# Altium project ORINIUM_UAV.PrjPcb (part 4 of 5)
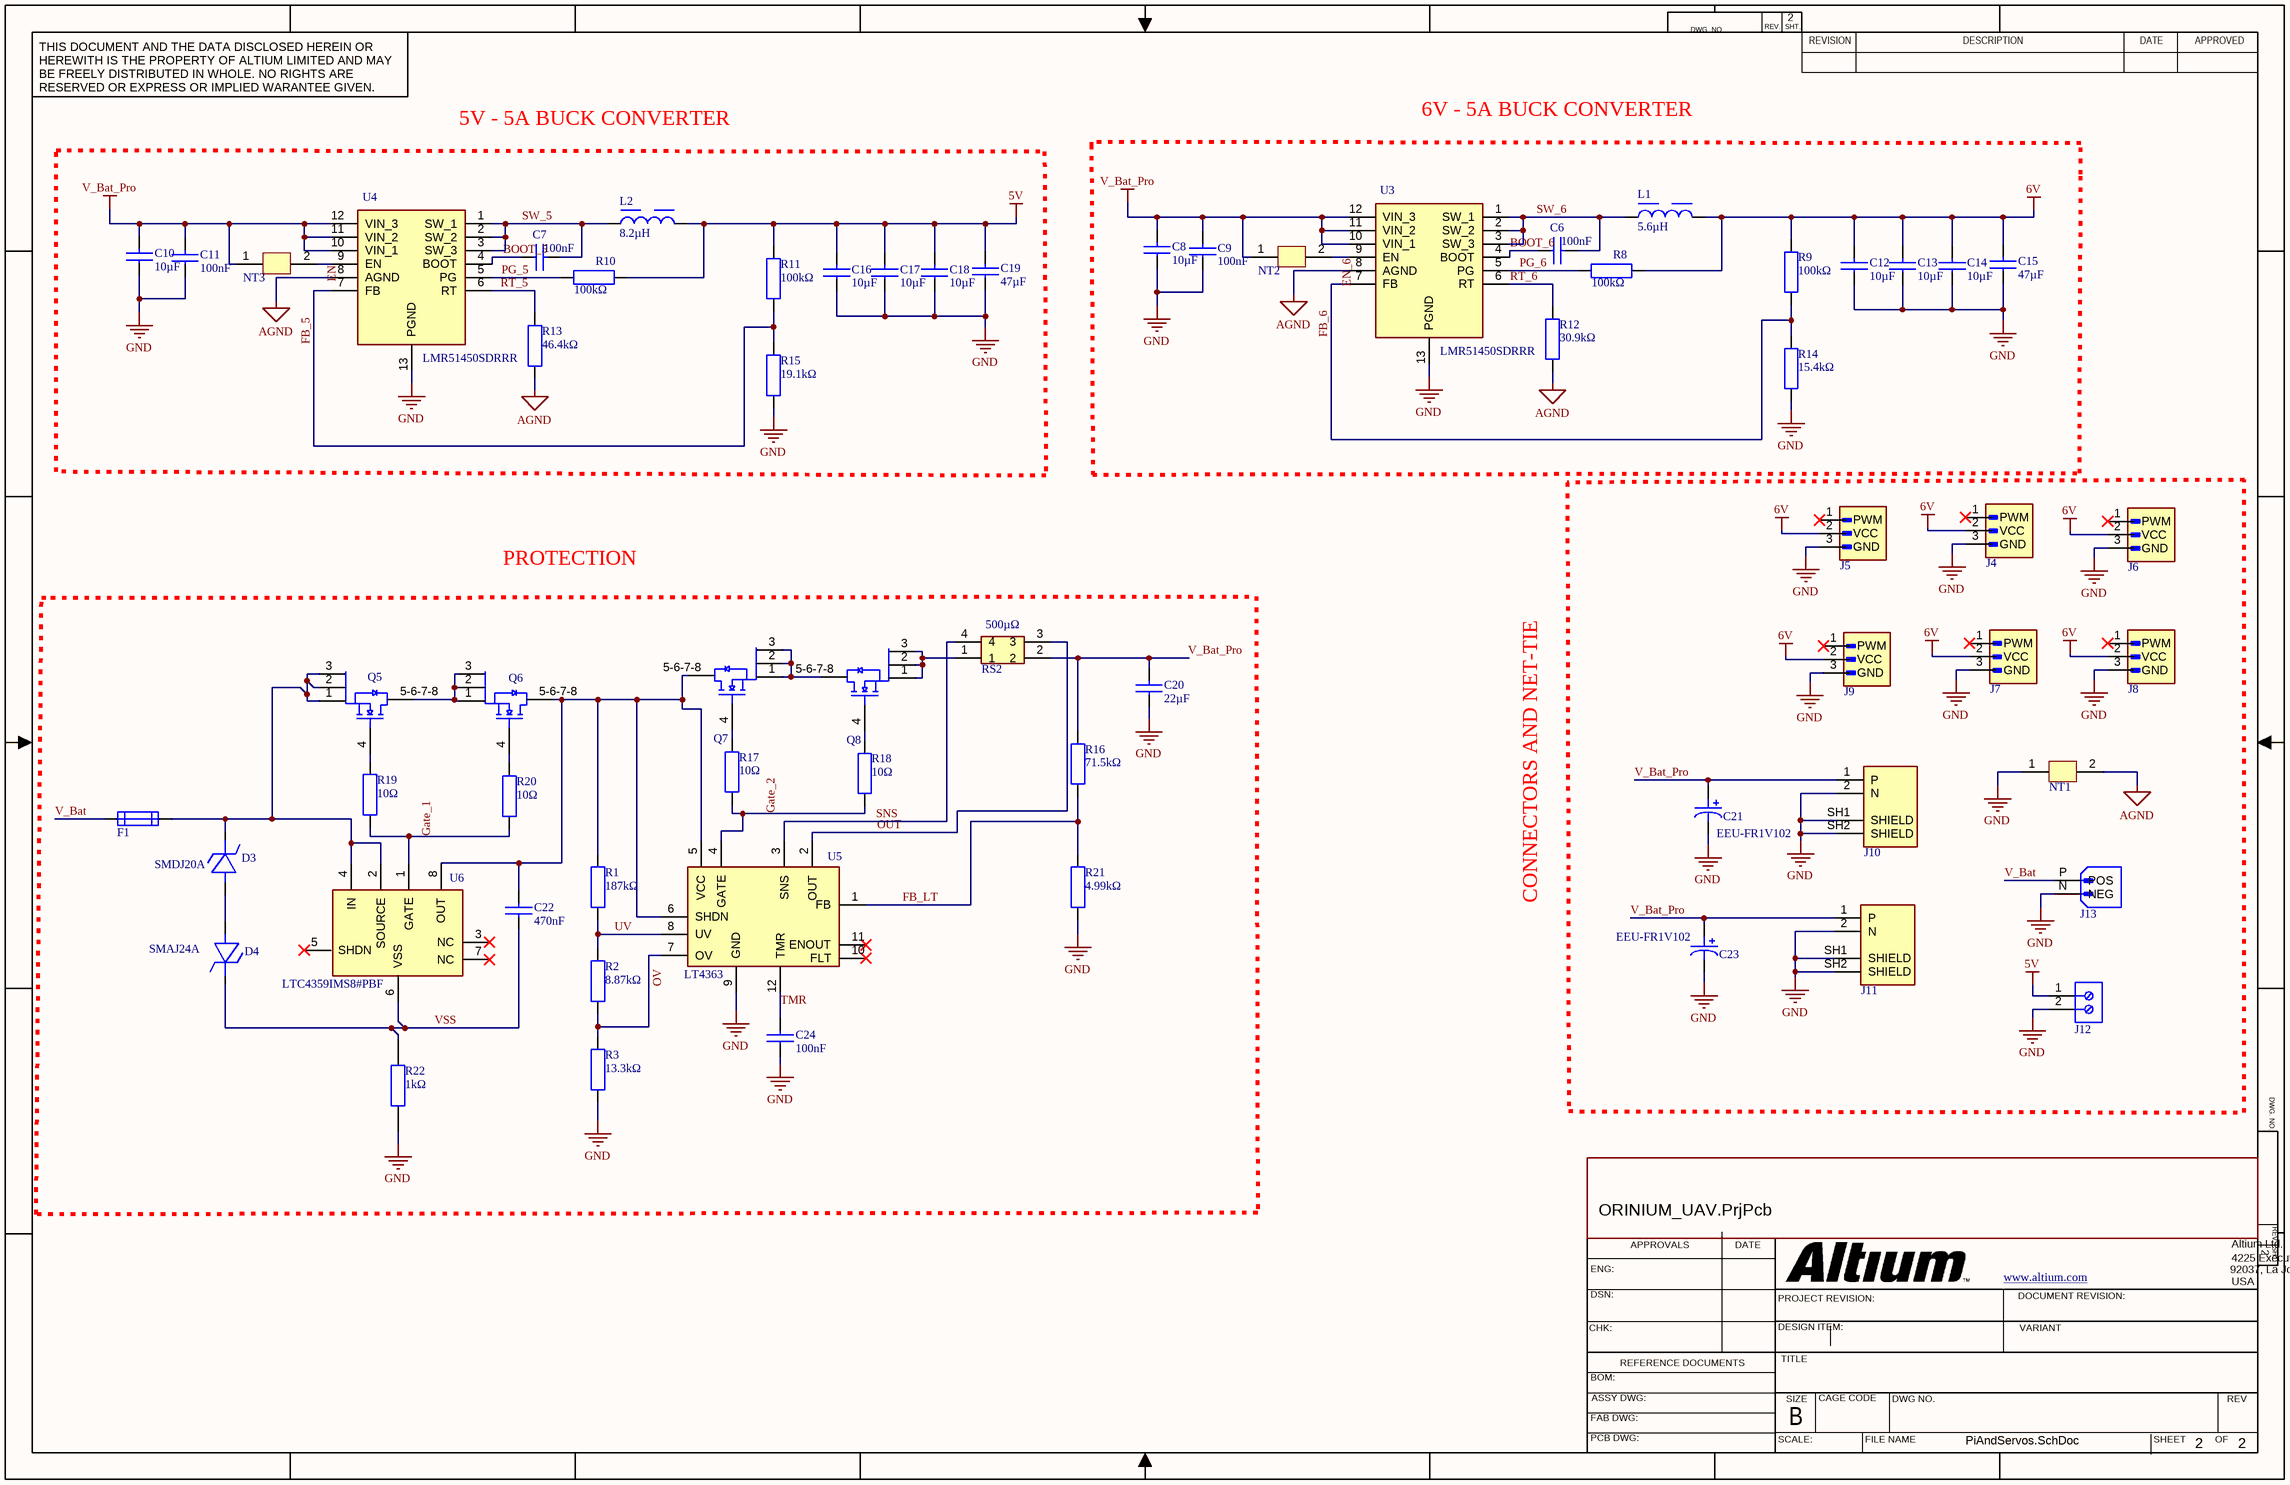
[diagram p3: PiAndServos.SchDoc]

## Sheet PiAndServos.SchDoc (continued)

### Library data of the parts (continued)
R13 = CRCW060346K4FKEA: Fixed Resistor, Metal Glaze/Thick Film, 0.1W, 46400ohm, 75V, 1% +/-Tol, Surface Mount, 0603; Manufacturer: Vishay; Max Power Dissipation: 100mW; Temperature Coefficient: 100ppm/°C; Supplier: Farnell; Supplier Part Number: CRCW060346K4FKEA; Manufacturer Part Number: CRCW060346K4FKEA; RoHS: Compliant; Category: Chip SMD Resistors; Stock: 5000; Pricing: 5000=0,0098 (EUR); Case/Package: 0603; Case Code (Imperial): 0603; China RoHS: Non-Compliant; Composition: Thick Film; Contact Plating: Tin; Country of Origin: Israel, Taiwan; Depth: 850µm; Export Control Classification Number (ECCN) Code: EAR99; Features: Automotive AEC-Q200; Height: 450µm; Harmonized Tariff Schedule (HTS) Code: 8533.21.00.30; Introduction Date: 2005-02-16; Lead Free: Lead Free; Length: 1.55mm; Lifecycle Status: Production; Max Operating Temperature: 155°C; Military Standard: Not; Min Operating Temperature: -55°C; Mounting Technology: Surface Mount; Pins: 2; Number of Terminals: 2; Number of Terminations: 2; Packaging: Cut Tape; Power Rating: 100mW; Radiation Hardening: No; Ratings: AEC-Q200; REACH SVHC: Yes; Schedule B: 8533210045, 8533210045|8533210045|8533210045|8533210045|8533210045|8533210045|8533210045|8533210045|8533210045|8533210045, 8533210045|8533210045|8533210045|8533210045|8533210045|8533210045|8533210045|8533210045|8533210045|8533210045|8533210045, 8533210045|8533210045|8533210045|8533210045|8533210045|8533210045|8533210045|8533210045|8533210045|8533210045|8533210045|8533210045; Termination: SMD/SMT; Tolerance: 1%; Voltage Rating: 75V; Weight: 2.012816mg; Width: 850µm; Working Voltage: 75V; ComponentLink1URL: https://datasheet.octopart.com:443/CRCW060346K4FKEA-Vishay-datasheet-175423584.pdf?src-supplier=IHS; ComponentLink1Description: https://datasheet.octopart.com:443/CRCW060346K4FKEA-Vishay-datasheet-175423584.pdf?src-supplier=IHS; ComponentLink2URL: https://datasheet.octopart.com:443/CRCW060346K4FKEA-Vishay-datasheet-62316122.pdf?src-supplier=Future+Electronics; ComponentLink2Description: https://datasheet.octopart.com:443/CRCW060346K4FKEA-Vishay-datasheet-62316122.pdf?src-supplier=Future+Electronics; ComponentLink3URL: https://datasheet.octopart.com:443/CRCW060346K4FKEA-Vishay-datasheet-12543454.pdf?src-supplier=Future+Electronics; ComponentLink3Description: https://datasheet.octopart.com:443/CRCW060346K4FKEA-Vishay-datasheet-12543454.pdf?src-supplier=Future+Electronics; ComponentLink4URL: https://datasheet.octopart.com:443/CRCW060346K4FKEA.-Vishay-datasheet-83961561.pdf?src-supplier=element14+APAC; ComponentLink4Description: https://datasheet.octopart.com:443/CRCW060346K4FKEA.-Vishay-datasheet-83961561.pdf?src-supplier=element14+APAC; ComponentLink5URL: https://datasheet.octopart.com:443/CRCW060346K4FKEA-Vishay-datasheet-62317933.pdf?src-supplier=element14+APAC; ComponentLink5Description: https://datasheet.octopart.com:443/CRCW060346K4FKEA-Vishay-datasheet-62317933.pdf?src-supplier=element14+APAC; ComponentLink6URL: https://datasheet.octopart.com:443/CRCW060346K4FKEA-Vishay-datasheet-14722531.pdf?src-supplier=element14+APAC; ComponentLink6Description: https://datasheet.octopart.com:443/CRCW060346K4FKEA-Vishay-datasheet-14722531.pdf?src-supplier=element14+APAC; ComponentLink7URL: https://datasheet.octopart.com:443/CRCW060346K4FKEA-Vishay-datasheet-5299586.pdf?src-supplier=element14+APAC; ComponentLink7Description: https://datasheet.octopart.com:443/CRCW060346K4FKEA-Vishay-datasheet-5299586.pdf?src-supplier=element14+APAC; ComponentLink8URL: https://datasheet.octopart.com:443/CRCW060346K4FKEA-Vishay-datasheet-10380026.pdf?src-supplier=element14+APAC; ComponentLink8Description: https://datasheet.octopart.com:443/CRCW060346K4FKEA-Vishay-datasheet-10380026.pdf?src-supplier=element14+APAC; ComponentLink9URL: https://datasheet.octopart.com:443/CRCW060346K4FKEA.-Vishay-datasheet-78776209.pdf?src-supplier=Newark; ComponentLink9Description: https://datasheet.octopart.com:443/CRCW060346K4FKEA.-Vishay-datasheet-78776209.pdf?src-supplier=Newark; ComponentLink10URL: https://datasheet.octopart.com:443/CRCW060346K4FKEA-Vishay-datasheet-66077789.pdf?src-supplier=Newark; ComponentLink10Description: https://datasheet.octopart.com:443/CRCW060346K4FKEA-Vishay-datasheet-66077789.pdf?src-supplier=Newark; ComponentLink11URL: https://datasheet.octopart.com:443/CRCW060346K4FKEA-Vishay-datasheet-11761042.pdf?src-supplier=Newark; ComponentLink11Description: https://datasheet.octopart.com:443/CRCW060346K4FKEA-Vishay-datasheet-11761042.pdf?src-supplier=Newark; ComponentLink12URL: https://datasheet.octopart.com:443/CRCW060346K4FKEA-Vishay-datasheet-11516975.pdf?src-supplier=Newark; ComponentLink12Description: https://datasheet.octopart.com:443/CRCW060346K4FKEA-Vishay-datasheet-11516975.pdf?src-supplier=Newark; ComponentLink13URL: https://datasheet.octopart.com:443/CRCW060346K4FKEA-Vishay-datasheet-159614168.pdf?src-supplier=Newark; ComponentLink13Description: https://datasheet.octopart.com:443/CRCW060346K4FKEA-Vishay-datasheet-159614168.pdf?src-supplier=Newark; ComponentLink14URL: https://datasheet.octopart.com:443/CRCW060346K4FKEA-Vishay-datasheet-41302739.pdf?src-supplier=Newark; ComponentLink14Description: https://datasheet.octopart.com:443/CRCW060346K4FKEA-Vishay-datasheet-41302739.pdf?src-supplier=Newark; ComponentLink15URL: https://datasheet.octopart.com:443/CRCW060346K4FKEA-Vishay-datasheet-33013972.pdf?src-supplier=Newark; ComponentLink15Description: https://datasheet.octopart.com:443/CRCW060346K4FKEA-Vishay-datasheet-33013972.pdf?src-supplier=Newark; ComponentLink16URL: https://datasheet.octopart.com:443/CRCW060346K4FKEA-Vishay-datasheet-21226360.pdf?src-supplier=Newark; ComponentLink16Description: https://datasheet.octopart.com:443/CRCW060346K4FKEA-Vishay-datasheet-21226360.pdf?src-supplier=Newark; ComponentLink17URL: https://datasheet.octopart.com:443/CRCW060346K4FKEA-Vishay-datasheet-137114372.pdf?src-supplier=X-ON; ComponentLink17Description: https://datasheet.octopart.com:443/CRCW060346K4FKEA-Vishay-datasheet-137114372.pdf?src-supplier=X-ON; ComponentLink18URL: https://datasheet.octopart.com:443/CRCW060346K4FKEA-Vishay-Dale-datasheet-47688880.pdf?src-supplier=RS+(Formerly+Allied+Electronics); ComponentLink18Description: https://datasheet.octopart.com:443/CRCW060346K4FKEA-Vishay-Dale-datasheet-47688880.pdf?src-supplier=RS+(Formerly+Allied+Electronics); ComponentLink19URL: https://datasheet.octopart.com:443/CRCW060346K4FKEA-Vishay-datasheet-12001583.pdf?src-supplier=RS+(Formerly+Allied+Electronics); ComponentLink19Description: https://datasheet.octopart.com:443/CRCW060346K4FKEA-Vishay-datasheet-12001583.pdf?src-supplier=RS+(Formerly+Allied+Electronics); ComponentLink20URL: https://datasheet.octopart.com:443/CRCW060346K4FKEA-Vishay-datasheet-5306405.pdf?src-supplier=RS+(Formerly+Allied+Electronics); ComponentLink20Description: https://datasheet.octopart.com:443/CRCW060346K4FKEA-Vishay-datasheet-5306405.pdf?src-supplier=RS+(Formerly+Allied+Electronics); ComponentLink21URL: https://datasheet.octopart.com:443/CRCW060346K4FKEA-Vishay-datasheet-11540273.pdf?src-supplier=Arrow+Electronics; ComponentLink21Description: https://datasheet.octopart.com:443/CRCW060346K4FKEA-Vishay-datasheet-11540273.pdf?src-supplier=Arrow+Electronics; ComponentLink22URL: https://datasheet.octopart.com:443/CRCW060346K4FKEA-Vishay-datasheet-8445837.pdf?src-supplier=element14; ComponentLink22Description: https://datasheet.octopart.com:443/CRCW060346K4FKEA-Vishay-datasheet-8445837.pdf?src-supplier=element14; ComponentLink23URL: https://datasheet.octopart.com:443/CRCW060346K4FKEA-Vishay-datasheet-5377433.pdf?src-supplier=Garrett; ComponentLink23Description: https://datasheet.octopart.com:443/CRCW060346K4FKEA-Vishay-datasheet-5377433.pdf?src-supplier=Garrett; ComponentLink24URL: https://datasheet.octopart.com:443/CRCW060346K4FKEA-Vishay-datasheet-148188.pdf?src-supplier=Garrett; ComponentLink24Description: https://datasheet.octopart.com:443/CRCW060346K4FKEA-Vishay-datasheet-148188.pdf?src-supplier=Garrett; ComponentLink25URL: https://datasheet.octopart.com:443/CRCW060346K4FKEA-Vishay-datasheet-30224.pdf?src-supplier=Garrett; ComponentLink25Description: https://datasheet.octopart.com:443/CRCW060346K4FKEA-Vishay-datasheet-30224.pdf?src-supplier=Garrett; ComponentLink26URL: http://sigma.octopart.com:80/rohs_statement/Vishay-company-15.pdf?src-supplier=Compliance+Statements; ComponentLink26Description: http://sigma.octopart.com:80/rohs_statement/Vishay-company-15.pdf?src-supplier=Compliance+Statements
R14 = AC0402FR-0715K4L: Res Thick Film 0402 15.4K Ohm 1% 0.063W(1/16W) ±100ppm/C Pad SMD Automotive T/R; Manufacturer: Yageo Group; Max Power Dissipation: 63mW; Power Rating: 62.5mW; Temperature Coefficient: 100ppm/°C; Voltage Rating: 50V; Supplier: Farnell; Supplier Part Number: AC0402FR-0715K4L.; Manufacturer Part Number: AC0402FR-0715K4L; RoHS: Compliant; Category: Chip SMD Resistors; Stock: 19685; Pricing: 1=0,0038 (EUR); Case/Package: 0402; Case Code (Imperial): 0402; Case Code (Metric): 1005; China RoHS: Non-Compliant; Composition: Thick Film; Features: Automotive AEC-Q200, Moisture Resistant; Height: 320µm; Length: 1mm; Lifecycle Status: Production; Max Operating Temperature: 155°C; Min Operating Temperature: -55°C; Mounting Technology: Surface Mount; Number of Terminals: 2; Number of Terminations: 2; Packaging: Tape & Reel; Ratings: AEC-Q200; REACH SVHC: Yes; Schedule B: 8533210045, 8533210045|8533210045|8533210045|8533210045|8533210045; Termination: SMD/SMT; Tolerance: 1%; Width: 500µm; Working Voltage: 50V; ComponentLink1URL: https://datasheet.octopart.com:443/AC0402FR-0715K4L-Yageo-datasheet-182189377.pdf?src-supplier=IHS; ComponentLink1Description: https://datasheet.octopart.com:443/AC0402FR-0715K4L-Yageo-datasheet-182189377.pdf?src-supplier=IHS; ComponentLink2URL: https://datasheet.octopart.com:443/AC0402FR-0715K4L-Yageo-datasheet-83209224.pdf?src-supplier=Upverter; ComponentLink2Description: https://datasheet.octopart.com:443/AC0402FR-0715K4L-Yageo-datasheet-83209224.pdf?src-supplier=Upverter; ComponentLink3URL: https://datasheet.octopart.com:443/AC0402FR-0715K4L-Yageo-datasheet-178509465.pdf?src-supplier=element14+APAC; ComponentLink3Description: https://datasheet.octopart.com:443/AC0402FR-0715K4L-Yageo-datasheet-178509465.pdf?src-supplier=element14+APAC; ComponentLink4URL: https://datasheet.octopart.com:443/AC0402FR-0715K4L-Yageo-Group-datasheet-189830439.pdf?src-supplier=Future+Electronics; ComponentLink4Description: https://datasheet.octopart.com:443/AC0402FR-0715K4L-Yageo-Group-datasheet-189830439.pdf?src-supplier=Future+Electronics; ComponentLink5URL: https://datasheet.octopart.com:443/AC0402FR-0715K4L-Yageo-datasheet-166720450.pdf?src-supplier=Future+Electronics; ComponentLink5Description: https://datasheet.octopart.com:443/AC0402FR-0715K4L-Yageo-datasheet-166720450.pdf?src-supplier=Future+Electronics; ComponentLink6URL: https://datasheet.octopart.com:443/AC0402FR-0715K4L-Yageo-datasheet-151884373.pdf?src-supplier=Future+Electronics; ComponentLink6Description: https://datasheet.octopart.com:443/AC0402FR-0715K4L-Yageo-datasheet-151884373.pdf?src-supplier=Future+Electronics; ComponentLink7URL: https://datasheet.octopart.com:443/AC0402FR-0715K4L-Yageo-datasheet-137699919.pdf?src-supplier=Future+Electronics; ComponentLink7Description: https://datasheet.octopart.com:443/AC0402FR-0715K4L-Yageo-datasheet-137699919.pdf?src-supplier=Future+Electronics; ComponentLink8URL: https://datasheet.octopart.com:443/AC0402FR-0715K4L-Yageo-Group-datasheet-164768995.pdf?src-supplier=ODG+(Origin+Data+Global); ComponentLink8Description: https://datasheet.octopart.com:443/AC0402FR-0715K4L-Yageo-Group-datasheet-164768995.pdf?src-supplier=ODG+(Origin+Data+Global); ComponentLink9URL: https://datasheet.octopart.com/AC0402FR-0715K4L-Yageo-datasheet-12512238.pdf; ComponentLink9Description: https://datasheet.octopart.com/AC0402FR-0715K4L-Yageo-datasheet-12512238.pdf; ComponentLink10URL: http://sigma.octopart.com:80/conflict_mineral_statement/Yageo-company-3.pdf?src-supplier=Compliance+Statements; ComponentLink10Description: http://sigma.octopart.com:80/conflict_mineral_statement/Yageo-company-3.pdf?src-supplier=Compliance+Statements; ComponentLink11URL: http://sigma.octopart.com:80/rohs_statement/Yageo-company-2.pdf?src-supplier=Compliance+Statements; ComponentLink11Description: http://sigma.octopart.com:80/rohs_statement/Yageo-company-2.pdf?src-supplier=Compliance+Statements
R15 = CRCW040219K1FKED: Res Thick Film 0402 19.1K Ohm 1% 1/16W ±100ppm/°C Molded SMD SMD Paper T/R; Manufacturer: Vishay; Max Power Dissipation: 63mW; Voltage Rating: 50V; Supplier: Farnell; Supplier Part Number: CRCW040219K1FKED; Manufacturer Part Number: CRCW040219K1FKED; RoHS: Compliant; Category: Chip SMD Resistors; Stock: 42036; Pricing: 10=0,02, 100=0,0145, 500=0,0117, 2500=0,0097, 5000=0,0094, 10000=0,009 (EUR); Case/Package: 0402; Case Code (Imperial): 0402; China RoHS: Non-Compliant; Composition: Thick Film; Contact Plating: Tin; Country of Origin: Israel, Taiwan; Depth: 500µm; Export Control Classification Number (ECCN) Code: EAR99; Features: Automotive AEC-Q200; Height: 350µm; Harmonized Tariff Schedule (HTS) Code: 8533.21.00.30; Introduction Date: 2005-03-24; Lead Free: Lead Free; Length: 1mm; Lifecycle Status: Production; Max Operating Temperature: 155°C; Military Standard: Not; Min Operating Temperature: -55°C; Mounting Technology: Surface Mount; Pins: 2; Number of Terminals: 2; Number of Terminations: 2; Packaging: Cut Tape; Power Rating: 63mW; Radiation Hardening: No; Ratings: AEC-Q200; REACH SVHC: Yes; Schedule B: 8533210045; Temperature Coefficient: 100ppm/°C; Termination: SMD/SMT; Tolerance: 1%; Voltage Rating (DC): 50V; Weight: 652.039032µg; Width: 500µm; Working Voltage: 50V; ComponentLink1URL: https://datasheet.octopart.com:443/CRCW040219K1FKED-Vishay-datasheet-175423584.pdf?src-supplier=IHS; ComponentLink1Description: https://datasheet.octopart.com:443/CRCW040219K1FKED-Vishay-datasheet-175423584.pdf?src-supplier=IHS; ComponentLink2URL: https://datasheet.octopart.com:443/CRCW040219K1FKED.-Vishay-datasheet-83961561.pdf?src-supplier=element14+APAC; ComponentLink2Description: https://datasheet.octopart.com:443/CRCW040219K1FKED.-Vishay-datasheet-83961561.pdf?src-supplier=element14+APAC; ComponentLink3URL: https://datasheet.octopart.com:443/CRCW040219K1FKED-Vishay-datasheet-66077789.pdf?src-supplier=element14+APAC; ComponentLink3Description: https://datasheet.octopart.com:443/CRCW040219K1FKED-Vishay-datasheet-66077789.pdf?src-supplier=element14+APAC; ComponentLink4URL: https://datasheet.octopart.com:443/CRCW040219K1FKED-Vishay-datasheet-62317933.pdf?src-supplier=element14+APAC; ComponentLink4Description: https://datasheet.octopart.com:443/CRCW040219K1FKED-Vishay-datasheet-62317933.pdf?src-supplier=element14+APAC; ComponentLink5URL: https://datasheet.octopart.com:443/CRCW040219K1FKED-Vishay-datasheet-14722531.pdf?src-supplier=element14+APAC; ComponentLink5Description: https://datasheet.octopart.com:443/CRCW040219K1FKED-Vishay-datasheet-14722531.pdf?src-supplier=element14+APAC; ComponentLink6URL: https://datasheet.octopart.com:443/CRCW040219K1FKED-Vishay-datasheet-5299586.pdf?src-supplier=element14+APAC; ComponentLink6Description: https://datasheet.octopart.com:443/CRCW040219K1FKED-Vishay-datasheet-5299586.pdf?src-supplier=element14+APAC; ComponentLink7URL: https://datasheet.octopart.com:443/CRCW040219K1FKED-Vishay-datasheet-10380026.pdf?src-supplier=element14+APAC; ComponentLink7Description: https://datasheet.octopart.com:443/CRCW040219K1FKED-Vishay-datasheet-10380026.pdf?src-supplier=element14+APAC; ComponentLink8URL: https://datasheet.octopart.com:443/CRCW040219K1FKED.-Vishay-datasheet-78776209.pdf?src-supplier=Newark; ComponentLink8Description: https://datasheet.octopart.com:443/CRCW040219K1FKED.-Vishay-datasheet-78776209.pdf?src-supplier=Newark; ComponentLink9URL: https://datasheet.octopart.com:443/CRCW040219K1FKED-Vishay-datasheet-11761042.pdf?src-supplier=Newark; ComponentLink9Description: https://datasheet.octopart.com:443/CRCW040219K1FKED-Vishay-datasheet-11761042.pdf?src-supplier=Newark; ComponentLink10URL: https://datasheet.octopart.com:443/CRCW040219K1FKED-Vishay-datasheet-11516975.pdf?src-supplier=Newark; ComponentLink10Description: https://datasheet.octopart.com:443/CRCW040219K1FKED-Vishay-datasheet-11516975.pdf?src-supplier=Newark; ComponentLink11URL: https://datasheet.octopart.com:443/CRCW040219K1FKED-Vishay-datasheet-159614168.pdf?src-supplier=Newark; ComponentLink11Description: https://datasheet.octopart.com:443/CRCW040219K1FKED-Vishay-datasheet-159614168.pdf?src-supplier=Newark; ComponentLink12URL: https://datasheet.octopart.com:443/CRCW040219K1FKED-Vishay-datasheet-41302739.pdf?src-supplier=Newark; ComponentLink12Description: https://datasheet.octopart.com:443/CRCW040219K1FKED-Vishay-datasheet-41302739.pdf?src-supplier=Newark; ComponentLink13URL: https://datasheet.octopart.com:443/CRCW040219K1FKED-Vishay-datasheet-33013972.pdf?src-supplier=Newark; ComponentLink13Description: https://datasheet.octopart.com:443/CRCW040219K1FKED-Vishay-datasheet-33013972.pdf?src-supplier=Newark; ComponentLink14URL: https://datasheet.octopart.com:443/CRCW040219K1FKED-Vishay-datasheet-21226360.pdf?src-supplier=Newark; ComponentLink14Description: https://datasheet.octopart.com:443/CRCW040219K1FKED-Vishay-datasheet-21226360.pdf?src-supplier=Newark; ComponentLink15URL: https://datasheet.octopart.com:443/CRCW040219K1FKED-Vishay-datasheet-62316122.pdf?src-supplier=Future+Electronics; ComponentLink15Description: https://datasheet.octopart.com:443/CRCW040219K1FKED-Vishay-datasheet-62316122.pdf?src-supplier=Future+Electronics; ComponentLink16URL: https://datasheet.octopart.com:443/CRCW040219K1FKED-Vishay-datasheet-12519820.pdf?src-supplier=Future+Electronics; ComponentLink16Description: https://datasheet.octopart.com:443/CRCW040219K1FKED-Vishay-datasheet-12519820.pdf?src-supplier=Future+Electronics; ComponentLink17URL: https://datasheet.octopart.com:443/CRCW040219K1FKED-Vishay-Dale-datasheet-47688880.pdf?src-supplier=RS+(Formerly+Allied+Electronics); ComponentLink17Description: https://datasheet.octopart.com:443/CRCW040219K1FKED-Vishay-Dale-datasheet-47688880.pdf?src-supplier=RS+(Formerly+Allied+Electronics); ComponentLink18URL: https://datasheet.octopart.com:443/CRCW040219K1FKED-Vishay-datasheet-12001583.pdf?src-supplier=RS+(Formerly+Allied+Electronics); ComponentLink18Description: https://datasheet.octopart.com:443/CRCW040219K1FKED-Vishay-datasheet-12001583.pdf?src-supplier=RS+(Formerly+Allied+Electronics); ComponentLink19URL: https://datasheet.octopart.com:443/CRCW040219K1FKED-Vishay-datasheet-5306405.pdf?src-supplier=RS+(Formerly+Allied+Electronics); ComponentLink19Description: https://datasheet.octopart.com:443/CRCW040219K1FKED-Vishay-datasheet-5306405.pdf?src-supplier=RS+(Formerly+Allied+Electronics); ComponentLink20URL: https://datasheet.octopart.com:443/CRCW040219K1FKED-Vishay-datasheet-11540273.pdf?src-supplier=Arrow+Electronics; ComponentLink20Description: https://datasheet.octopart.com:443/CRCW040219K1FKED-Vishay-datasheet-11540273.pdf?src-supplier=Arrow+Electronics; ComponentLink21URL: https://datasheet.octopart.com:443/CRCW040219K1FKED-Vishay-datasheet-8445837.pdf?src-supplier=element14; ComponentLink21Description: https://datasheet.octopart.com:443/CRCW040219K1FKED-Vishay-datasheet-8445837.pdf?src-supplier=element14; ComponentLink22URL: https://datasheet.octopart.com:443/CRCW040219K1FKED-Vishay-datasheet-5377255.pdf?src-supplier=Garrett; ComponentLink22Description: https://datasheet.octopart.com:443/CRCW040219K1FKED-Vishay-datasheet-5377255.pdf?src-supplier=Garrett; ComponentLink23URL: https://datasheet.octopart.com:443/CRCW040219K1FKED-Vishay-datasheet-148188.pdf?src-supplier=Garrett; ComponentLink23Description: https://datasheet.octopart.com:443/CRCW040219K1FKED-Vishay-datasheet-148188.pdf?src-supplier=Garrett; ComponentLink24URL: https://datasheet.octopart.com:443/CRCW040219K1FKED-Vishay-datasheet-42367.pdf?src-supplier=Garrett; ComponentLink24Description: https://datasheet.octopart.com:443/CRCW040219K1FKED-Vishay-datasheet-42367.pdf?src-supplier=Garrett; ComponentLink25URL: http://sigma.octopart.com:80/rohs_statement/Vishay-company-15.pdf?src-supplier=Compliance+Statements; ComponentLink25Description: http://sigma.octopart.com:80/rohs_statement/Vishay-company-15.pdf?src-supplier=Compliance+Statements
R16 = RC0603FR-0771K5L: Res Thick Film 0603 71.5K Ohm 1% 0.1W(1/10W) ±100ppm/C Pad SMD T/R; Manufacturer: Yageo Group; Max Power Dissipation: 100mW; Temperature Coefficient: 100ppm/°C; Voltage Rating: 75V; Voltage Rating (DC): 50V; Supplier: Farnell; Supplier Part Number: RC0603FR-0771K5L; Manufacturer Part Number: RC0603FR-0771K5L; RoHS: Compliant; Category: Chip SMD Resistors; Stock: 10380; Pricing: 10=0,0061, 100=0,0052, 500=0,0048, 1000=0,0043, 2500=0,0037 (EUR); Case/Package: 0603; Case Code (Imperial): 0603; China RoHS: Non-Compliant; Composition: Thick Film; Country of Origin: Mainland China, Taiwan; Export Control Classification Number (ECCN) Code: EAR99; Features: Moisture Resistant; Height: 450µm; Harmonized Tariff Schedule (HTS) Code: 8533.21.00.30; Introduction Date: 2004-09-22; Lead Free: Lead Free; Length: 1.6mm; Lifecycle Status: Production; Max Operating Temperature: 155°C; Min Operating Temperature: -55°C; Mounting Technology: Surface Mount; Number of Terminals: 2; Number of Terminations: 2; Packaging: Tape & Reel; Power Rating: 100mW; REACH SVHC: Yes; Schedule B: 8533210045, 8533210045|8533210045, 8533210045|8533210045|8533210045, 8533210045|8533210045|8533210045|8533210045; Termination: SMD/SMT; Tolerance: 1%; Weight: 2.012816mg; Width: 800µm; Working Voltage: 75V; ComponentLink1URL: https://datasheet.octopart.com:443/RC0603FR-0771K5L-Yageo-datasheet-175887523.pdf?src-supplier=Newark; ComponentLink1Description: https://datasheet.octopart.com:443/RC0603FR-0771K5L-Yageo-datasheet-175887523.pdf?src-supplier=Newark; ComponentLink2URL: https://datasheet.octopart.com:443/RC0603FR-0771K5L-Yageo-datasheet-103092701.pdf?src-supplier=Upverter; ComponentLink2Description: https://datasheet.octopart.com:443/RC0603FR-0771K5L-Yageo-datasheet-103092701.pdf?src-supplier=Upverter; ComponentLink3URL: https://datasheet.octopart.com:443/RC0603FR-0771K5L-Yageo-Group-datasheet-190305687.pdf?src-supplier=Future+Electronics; ComponentLink3Description: https://datasheet.octopart.com:443/RC0603FR-0771K5L-Yageo-Group-datasheet-190305687.pdf?src-supplier=Future+Electronics; ComponentLink4URL: https://datasheet.octopart.com:443/RC0603FR-0771K5L-Yageo-datasheet-164759695.pdf?src-supplier=Future+Electronics; ComponentLink4Description: https://datasheet.octopart.com:443/RC0603FR-0771K5L-Yageo-datasheet-164759695.pdf?src-supplier=Future+Electronics; ComponentLink5URL: https://datasheet.octopart.com:443/RC0603FR-0771K5L-Yageo-datasheet-137700087.pdf?src-supplier=Future+Electronics; ComponentLink5Description: https://datasheet.octopart.com:443/RC0603FR-0771K5L-Yageo-datasheet-137700087.pdf?src-supplier=Future+Electronics; ComponentLink6URL: https://datasheet.octopart.com:443/RC0603FR-0771K5L-Yageo-datasheet-17842380.pdf?src-supplier=Future+Electronics; ComponentLink6Description: https://datasheet.octopart.com:443/RC0603FR-0771K5L-Yageo-datasheet-17842380.pdf?src-supplier=Future+Electronics; ComponentLink7URL: https://datasheet.octopart.com:443/RC0603FR-0771K5L-Yageo-datasheet-15599030.pdf?src-supplier=Future+Electronics; ComponentLink7Description: https://datasheet.octopart.com:443/RC0603FR-0771K5L-Yageo-datasheet-15599030.pdf?src-supplier=Future+Electronics; ComponentLink8URL: https://datasheet.octopart.com:443/RC0603FR-0771K5L-Yageo-datasheet-12596169.pdf?src-supplier=Future+Electronics; ComponentLink8Description: https://datasheet.octopart.com:443/RC0603FR-0771K5L-Yageo-datasheet-12596169.pdf?src-supplier=Future+Electronics; ComponentLink9URL: https://datasheet.octopart.com:443/RC0603FR-0771K5L-Yageo-datasheet-8328172.pdf?src-supplier=Future+Electronics; ComponentLink9Description: https://datasheet.octopart.com:443/RC0603FR-0771K5L-Yageo-datasheet-8328172.pdf?src-supplier=Future+Electronics; ComponentLink10URL: https://datasheet.octopart.com:443/RC0603FR-0771K5L-Yageo-Group-datasheet-189192902.pdf?src-supplier=TME; ComponentLink10Description: https://datasheet.octopart.com:443/RC0603FR-0771K5L-Yageo-Group-datasheet-189192902.pdf?src-supplier=TME; ComponentLink11URL: https://datasheet.octopart.com:443/RC0603FR-0771K5L-Yageo-Group-datasheet-176638170.pdf?src-supplier=TME; ComponentLink11Description: https://datasheet.octopart.com:443/RC0603FR-0771K5L-Yageo-Group-datasheet-176638170.pdf?src-supplier=TME; ComponentLink12URL: https://datasheet.octopart.com:443/RC0603FR-0771K5L-Yageo-datasheet-79472498.pdf?src-supplier=Megastar; ComponentLink12Description: https://datasheet.octopart.com:443/RC0603FR-0771K5L-Yageo-datasheet-79472498.pdf?src-supplier=Megastar; ComponentLink13URL: https://datasheet.octopart.com/RC0603FR-0771K5L-Yageo-datasheet-73766026.pdf; ComponentLink13Description: https://datasheet.octopart.com/RC0603FR-0771K5L-Yageo-datasheet-73766026.pdf; ComponentLink14URL: https://datasheet.octopart.com:443/RC0603FR-0771K5L-Yageo-datasheet-118562.pdf?src-supplier=DigiKey; ComponentLink14Description: https://datasheet.octopart.com:443/RC0603FR-0771K5L-Yageo-datasheet-118562.pdf?src-supplier=DigiKey; ComponentLink15URL: http://sigma.octopart.com:80/conflict_mineral_statement/Yageo-company-3.pdf?src-supplier=Compliance+Statements; ComponentLink15Description: http://sigma.octopart.com:80/conflict_mineral_statement/Yageo-company-3.pdf?src-supplier=Compliance+Statements; ComponentLink16URL: http://sigma.octopart.com:80/rohs_statement/Yageo-company-2.pdf?src-supplier=Compliance+Statements; ComponentLink16Description: http://sigma.octopart.com:80/rohs_statement/Yageo-company-2.pdf?src-supplier=Compliance+Statements
R17-R20 = SR0805FR-7W10RL: Res Thick Film 0805 10 Ohm 1% 0.25W(1/4W) ±200ppm/C Pad SMD Automotive T/R; Manufacturer: Yageo Group; Power Rating: 250mW; Temperature Coefficient: 100ppm/°C; Voltage Rating: 150V; Working Voltage: 500V; Supplier: Arrow Electronics; Supplier Part Number: SR0805FR-7W10RL; Manufacturer Part Number: SR0805FR-7W10RL; RoHS: Compliant; Category: Chip SMD Resistors; Stock: 30000; Pricing: 5000=0,0587, 10000=0,0564 (USD); Case/Package: 0805; China RoHS: Non-Compliant; Composition: Thick Film; Country of Origin: Mainland China, Taiwan; Export Control Classification Number (ECCN) Code: EAR99; Height: 500µm; Harmonized Tariff Schedule (HTS) Code: 8533.21.00.30; Introduction Date: 2017-06-07; Length: 2mm; Lifecycle Status: Production; Max Operating Temperature: 155°C; Min Operating Temperature: -55°C; Mounting Technology: Surface Mount; Number of Terminals: 2; Packaging: Tape & Reel; Ratings: AEC-Q200; REACH SVHC: Yes; Tolerance: 1%; Width: 1.25mm; ComponentLink1URL: https://datasheet.octopart.com:443/SR0805FR-7W10RL-Yageo-datasheet-176402240.pdf?src-supplier=JRH+Electronics; ComponentLink1Description: https://datasheet.octopart.com:443/SR0805FR-7W10RL-Yageo-datasheet-176402240.pdf?src-supplier=JRH+Electronics; ComponentLink2URL: https://datasheet.octopart.com:443/SR0805FR-7W10RL-Yageo-datasheet-119732217.pdf?src-supplier=Upverter; ComponentLink2Description: https://datasheet.octopart.com:443/SR0805FR-7W10RL-Yageo-datasheet-119732217.pdf?src-supplier=Upverter; ComponentLink3URL: https://datasheet.octopart.com:443/SR0805FR-7W10RL-Yageo-datasheet-155675517.pdf?src-supplier=ODG+(Origin+Data+Global); ComponentLink3Description: https://datasheet.octopart.com:443/SR0805FR-7W10RL-Yageo-datasheet-155675517.pdf?src-supplier=ODG+(Origin+Data+Global); ComponentLink4URL: https://datasheet.octopart.com:443/SR0805FR-7W10RL-Yageo-Group-datasheet-184785656.pdf?src-supplier=Future+Electronics; ComponentLink4Description: https://datasheet.octopart.com:443/SR0805FR-7W10RL-Yageo-Group-datasheet-184785656.pdf?src-supplier=Future+Electronics; ComponentLink5URL: https://datasheet.octopart.com:443/SR0805FR-7W10RL-Yageo-datasheet-137701088.pdf?src-supplier=Future+Electronics; ComponentLink5Description: https://datasheet.octopart.com:443/SR0805FR-7W10RL-Yageo-datasheet-137701088.pdf?src-supplier=Future+Electronics; ComponentLink6URL: https://datasheet.octopart.com:443/SR0805FR-7W10RL-Yageo-Group-datasheet-188692432.pdf?src-supplier=Farnell; ComponentLink6Description: https://datasheet.octopart.com:443/SR0805FR-7W10RL-Yageo-Group-datasheet-188692432.pdf?src-supplier=Farnell; ComponentLink7URL: https://datasheet.octopart.com/SR0805FR-7W10RL-Yageo-datasheet-11047080.pdf; ComponentLink7Description: https://datasheet.octopart.com/SR0805FR-7W10RL-Yageo-datasheet-11047080.pdf; ComponentLink8URL: http://sigma.octopart.com:80/conflict_mineral_statement/Yageo-company-3.pdf?src-supplier=Compliance+Statements; ComponentLink8Description: http://sigma.octopart.com:80/conflict_mineral_statement/Yageo-company-3.pdf?src-supplier=Compliance+Statements; ComponentLink9URL: http://sigma.octopart.com:80/rohs_statement/Yageo-company-2.pdf?src-supplier=Compliance+Statements; ComponentLink9Description: http://sigma.octopart.com:80/rohs_statement/Yageo-company-2.pdf?src-supplier=Compliance+Statements
R21 = ERJ-2RKF4991X: Res Thick Film 0402 4.99K Ohm 1% 0.1W(1/10W) ±100ppm/C Pad SMD Automotive T/R; Manufacturer: Panasonic; Manufacturer Part Number: ERJ2RKF4991X; Manufacturer Lifecycle Status: ACTIVE; Part Series: Precision Thick Film Chip Resistors; Max Power Dissipation: 100mW; Temperature Coefficient: 100ppm/°C; Voltage Rating: 50V; Supplier: Farnell; Supplier Part Number: ERJ2RKF4991X; RoHS: Compliant; Category: Chip SMD Resistors; Stock: 140569; Pricing: 10=0,0178, 100=0,0146, 500=0,0095, 2500=0,0084, 5000=0,0074 (EUR); Case/Package: 0402; Case Code (Imperial): 0402; China RoHS: Non-Compliant; Composition: Thick Film; Contact Plating: Tin; Country of Origin: Japan, Mainland China; Depth: 500µm; Export Control Classification Number (ECCN) Code: EAR99; Features: Automotive AEC-Q200; Height: 350µm; Harmonized Tariff Schedule (HTS) Code: 8533.21.00.30; Introduction Date: 2004-02-02; Lead Free: Lead Free; Length: 1mm; Lifecycle Status: Production; Max Operating Temperature: 155°C; Military Standard: Not; Min Operating Temperature: -55°C; Mounting Technology: Surface Mount; Pins: 2; Number of Terminals: 2; Number of Terminations: 2; Packaging: Cut Tape; Power Rating: 100mW; Radiation Hardening: No; Ratings: AEC-Q200; REACH SVHC: Yes; Schedule B: 8533210045, 8533210045|8533210045|8533210045|8533210045|8533210045; Termination: SMD/SMT; Tolerance: 1%; Voltage Rating (DC): 50V; Weight: 793.786648µg; Width: 500µm; Working Voltage: 50V; ComponentLink1URL: https://sigma.octopart.com:443/138766958/technical_drawing/Panasonic-ERJ-2RKF4991X.pdf?src-supplier=Upverter; ComponentLink1Description: https://sigma.octopart.com:443/138766958/technical_drawing/Panasonic-ERJ-2RKF4991X.pdf?src-supplier=Upverter; ComponentLink2URL: https://datasheet.octopart.com:443/ERJ2RKF4991X-Panasonic-datasheet-82288794.pdf?src-supplier=Upverter; ComponentLink2Description: https://datasheet.octopart.com:443/ERJ2RKF4991X-Panasonic-datasheet-82288794.pdf?src-supplier=Upverter; ComponentLink3URL: https://datasheet.octopart.com:443/ERJ2RKF4991X-Panasonic-datasheet-13266541.pdf?src-supplier=RS+(Formerly+Allied+Electronics); ComponentLink3Description: https://datasheet.octopart.com:443/ERJ2RKF4991X-Panasonic-datasheet-13266541.pdf?src-supplier=RS+(Formerly+Allied+Electronics); ComponentLink4URL: https://datasheet.octopart.com:443/ERJ2RKF4991X-Panasonic-datasheet-48891056.pdf?src-supplier=Newark; ComponentLink4Description: https://datasheet.octopart.com:443/ERJ2RKF4991X-Panasonic-datasheet-48891056.pdf?src-supplier=Newark; ComponentLink5URL: https://datasheet.octopart.com:443/ERJ2RKF4991X-Panasonic-datasheet-136608610.pdf?src-supplier=Newark; ComponentLink5Description: https://datasheet.octopart.com:443/ERJ2RKF4991X-Panasonic-datasheet-136608610.pdf?src-supplier=Newark; ComponentLink6URL: https://datasheet.octopart.com:443/ERJ2RKF4991X-Panasonic-datasheet-10025800.pdf?src-supplier=Future+Electronics; ComponentLink6Description: https://datasheet.octopart.com:443/ERJ2RKF4991X-Panasonic-datasheet-10025800.pdf?src-supplier=Future+Electronics; ComponentLink7URL: https://datasheet.octopart.com:443/ERJ2RKF4991X-Panasonic-datasheet-8853621.pdf?src-supplier=Future+Electronics; ComponentLink7Description: https://datasheet.octopart.com:443/ERJ2RKF4991X-Panasonic-datasheet-8853621.pdf?src-supplier=Future+Electronics; ComponentLink8URL: https://datasheet.octopart.com:443/ERJ2RKF4991X-Panasonic-datasheet-5313456.pdf?src-supplier=Future+Electronics; ComponentLink8Description: https://datasheet.octopart.com:443/ERJ2RKF4991X-Panasonic-datasheet-5313456.pdf?src-supplier=Future+Electronics; ComponentLink9URL: https://datasheet.octopart.com:443/ERJ-2RKF4991X-Panasonic-datasheet-154766169.pdf?src-supplier=Master+Electronics; ComponentLink9Description: https://datasheet.octopart.com:443/ERJ-2RKF4991X-Panasonic-datasheet-154766169.pdf?src-supplier=Master+Electronics; ComponentLink10URL: https://datasheet.octopart.com:443/ERJ2RKF4991X-Panasonic-datasheet-188592431.pdf?src-supplier=TME; ComponentLink10Description: https://datasheet.octopart.com:443/ERJ2RKF4991X-Panasonic-datasheet-188592431.pdf?src-supplier=TME; ComponentLink11URL: https://datasheet.octopart.com:443/ERJ2RKF4991X-Panasonic-datasheet-164353789.pdf?src-supplier=TME; ComponentLink11Description: https://datasheet.octopart.com:443/ERJ2RKF4991X-Panasonic-datasheet-164353789.pdf?src-supplier=TME; ComponentLink12URL: https://datasheet.octopart.com/ERJ2RKF4991X-Panasonic-datasheet-78375410.pdf; ComponentLink12Description: https://datasheet.octopart.com/ERJ2RKF4991X-Panasonic-datasheet-78375410.pdf; ComponentLink13URL: https://datasheet.octopart.com/Precision-Thick-Film-Chip-Resistors-Panasonic-datasheet-family-106.pdf; ComponentLink13Description: https://datasheet.octopart.com/Precision-Thick-Film-Chip-Resistors-Panasonic-datasheet-family-106.pdf; ComponentLink14URL: https://datasheet.octopart.com:443/ERJ-2RKF4991X-Panasonic---ECG-datasheet-15994758.pdf?src-supplier=Farnell; ComponentLink14Description: https://datasheet.octopart.com:443/ERJ-2RKF4991X-Panasonic---ECG-datasheet-15994758.pdf?src-supplier=Farnell; ComponentLink15URL: https://datasheet.octopart.com:443/ERJ-2RKF4991X-Panasonic-datasheet-11542829.pdf?src-supplier=Arrow+Electronics; ComponentLink15Description: https://datasheet.octopart.com:443/ERJ-2RKF4991X-Panasonic-datasheet-11542829.pdf?src-supplier=Arrow+Electronics; ComponentLink16URL: https://datasheet.octopart.com:443/ERJ-2RKF4991X-Panasonic-datasheet-118621.pdf?src-supplier=DigiKey; ComponentLink16Description: https://datasheet.octopart.com:443/ERJ-2RKF4991X-Panasonic-datasheet-118621.pdf?src-supplier=DigiKey; ComponentLink17URL: https://datasheet.octopart.com:443/ERJ-2RKF4991X-Panasonic-datasheet-41391857.pdf?src-supplier=Electro+Sonic; ComponentLink17Description: https://datasheet.octopart.com:443/ERJ-2RKF4991X-Panasonic-datasheet-41391857.pdf?src-supplier=Electro+Sonic
R22 = SR1206FR-071KL: Fixed Resistor, Metal Glaze/thick Film, 0.25W, 1000ohm, 500V, 1% +/-Tol, 100ppm/Cel, Surface Mount, 1206; Manufacturer: Yageo Group; Max Power Dissipation: 250mW; Temperature Coefficient: 100ppm/°C; Working Voltage: 200V; Supplier: Avnet; Supplier Part Number: SR1206FR-071KL; Manufacturer Part Number: SR1206FR-071KL; RoHS: Compliant; Category: Chip SMD Resistors; Pricing: 5000=0,02852, 10000=0,02837, 20000=0,02823, 30000=0,02808, 40000=0,02794 (USD); Case/Package: 1206; China RoHS: Non-Compliant; Composition: Thick Film; Country of Origin: Mainland China, Taiwan; Export Control Classification Number (ECCN) Code: EAR99; Features: Automotive AEC-Q200; Height: 550µm; Harmonized Tariff Schedule (HTS) Code: 8533.21.00.30; Introduction Date: 2015-12-01; Length: 3.1mm; Lifecycle Status: Production; Max Operating Temperature: 155°C; Min Operating Temperature: -55°C; Mounting Technology: Surface Mount; Number of Terminals: 2; Number of Terminations: 2; Packaging: Tape & Reel; Power Rating: 250mW; Ratings: AEC-Q200; REACH SVHC: Yes; Tolerance: 1%; Width: 1.6mm; ComponentLink1URL: https://datasheet.octopart.com:443/SR1206FR-071KL-Yageo-datasheet-176402240.pdf?src-supplier=IHS; ComponentLink1Description: https://datasheet.octopart.com:443/SR1206FR-071KL-Yageo-datasheet-176402240.pdf?src-supplier=IHS; ComponentLink2URL: https://datasheet.octopart.com/SR1206FR-071KL-Yageo-datasheet-11047080.pdf; ComponentLink2Description: https://datasheet.octopart.com/SR1206FR-071KL-Yageo-datasheet-11047080.pdf; ComponentLink3URL: http://sigma.octopart.com:80/conflict_mineral_statement/Yageo-company-3.pdf?src-supplier=Compliance+Statements; ComponentLink3Description: http://sigma.octopart.com:80/conflict_mineral_statement/Yageo-company-3.pdf?src-supplier=Compliance+Statements; ComponentLink4URL: http://sigma.octopart.com:80/rohs_statement/Yageo-company-2.pdf?src-supplier=Compliance+Statements; ComponentLink4Description: http://sigma.octopart.com:80/rohs_statement/Yageo-company-2.pdf?src-supplier=Compliance+Statements
RS2 = WSLP4026L5000FEA: Res Metal Strip 4026 0.0005 Ohm 1% 7W ±75ppm/C Metal Pad SMD Automotive T/R; Manufacturer: Vishay; Temperature Coefficient: 75ppm/°C; Working Voltage: 59.2mV; Supplier: Future Electronics; Supplier Part Number: WSLP4026L5000FEA; Manufacturer Part Number: WSLP4026L5000FEA; RoHS: Compliant; Category: Chip SMD Resistors; Pricing: 1500=2 (USD); Case/Package: 4026; Case Code (Imperial): 4026; Case Code (Metric): 1066; China RoHS: Compliant; Composition: Metal Strip; Features: Moisture Resistant; Height: 2.95mm; Length: 10.1mm; Lifecycle Status: Production; Max Operating Temperature: 170°C; Max Power Dissipation: 7W; Min Operating Temperature: -65°C; Mounting Technology: Surface Mount; Number of Terminals: 4; Number of Terminations: 4; Power Rating: 7W; Ratings: AEC-Q200; REACH SVHC: Yes; Tolerance: 1%; Width: 6.6mm; ComponentLink1URL: https://datasheet.octopart.com:443/WSLP4026L5000FEA-Vishay-datasheet-181963782.pdf?src-supplier=IHS; ComponentLink1Description: https://datasheet.octopart.com:443/WSLP4026L5000FEA-Vishay-datasheet-181963782.pdf?src-supplier=IHS; ComponentLink2URL: https://datasheet.octopart.com:443/WSLP4026L5000FEA-Vishay-datasheet-62319862.pdf?src-supplier=Newark; ComponentLink2Description: https://datasheet.octopart.com:443/WSLP4026L5000FEA-Vishay-datasheet-62319862.pdf?src-supplier=Newark; ComponentLink3URL: https://datasheet.octopart.com:443/WSLP4026L5000FEA-Vishay-datasheet-25365648.pdf?src-supplier=Newark; ComponentLink3Description: https://datasheet.octopart.com:443/WSLP4026L5000FEA-Vishay-datasheet-25365648.pdf?src-supplier=Newark; ComponentLink4URL: https://datasheet.octopart.com:443/WSLP4026L5000FEA-Vishay-datasheet-179246766.pdf?src-supplier=TME; ComponentLink4Description: https://datasheet.octopart.com:443/WSLP4026L5000FEA-Vishay-datasheet-179246766.pdf?src-supplier=TME; ComponentLink5URL: https://datasheet.octopart.com:443/WSLP4026L5000FEA-Vishay-datasheet-83134227.pdf?src-supplier=Future+Electronics; ComponentLink5Description: https://datasheet.octopart.com:443/WSLP4026L5000FEA-Vishay-datasheet-83134227.pdf?src-supplier=Future+Electronics; ComponentLink6URL: http://sigma.octopart.com:80/rohs_statement/Vishay-company-15.pdf?src-supplier=Compliance+Statements; ComponentLink6Description: http://sigma.octopart.com:80/rohs_statement/Vishay-company-15.pdf?src-supplier=Compliance+Statements
U3 U4 = LMR51450SDRRR: 36-V, 5-A synchronous buck converter 12-WSON -40 to 150; Manufacturer: Texas Instruments; Manufacturer Lifecycle Status: ACTIVE; Supplier: Mouser; Supplier Part Number: 595-LMR51450SDRRR; Manufacturer Part Number: LMR51450SDRRR; RoHS: Compliant; Category: Voltage Regulators - Switching; Stock: 10485; Pricing: 1=2,09, 10=1,55, 25=1,21, 50=1,41, 100=1,26, 250=1,02, 500=0,989, 1000=1,12, 3000=0,912, 6000=0,894, 10000=1,04 (USD); Height: 800µm; Length: 3mm; Lifecycle Status: Production; Pins: 12; Thickness: 750µm; Topology: Buck; Width: 3mm; ComponentLink1URL: https://sigma.octopart.com:443/176290362/technical_drawing/Texas-Instruments-LMR51450SDRRR.pdf?src-supplier=Texas+Instruments; ComponentLink1Description: https://sigma.octopart.com:443/176290362/technical_drawing/Texas-Instruments-LMR51450SDRRR.pdf?src-supplier=Texas+Instruments; ComponentLink2URL: https://octopart.com:443/opatz8j6/c1?t=oKmyWqts6puNCi1v3ksvyO_vfq3ggcIB7cLGQldxbuOVyJ2TFptYEr69Ct5zwwS27jB0eCEQmCCKAW0OQIoRJykQdN7zvcetqeBE4vcrznlT4iEwq70pGT65pQlL_vBuRAsQBYuHkuAKhQPqLjNJBAf_UHvlhvAI5V1vBDPE-GaOz1Aorf-oNHzVde5dNsY22KmRXwnkmrR3bIZCiYCZbAW_Puxd4cX9xxBVyl9CKGxvoLBhhxyPskgyHuRp_NXLSMzY3IgXJcNIpIVt4RSz7U2IMFHEbjpGuy9WrwBPQJ_4vp9lxeZTTlW2WL_vl-zPz7rsAhMOw4qcn51tjFlTHkeCOO4cweonyf1vxlmxISf1XW7c1fLTpz-Iaj6G-19_iAkAh8qPIg&src-supplier=Texas+Instruments; ComponentLink2Description: https://octopart.com:443/opatz8j6/c1?t=oKmyWqts6puNCi1v3ksvyO_vfq3ggcIB7cLGQldxbuOVyJ2TFptYEr69Ct5zwwS27jB0eCEQmCCKAW0OQIoRJykQdN7zvcetqeBE4vcrznlT4iEwq70pGT65pQlL_vBuRAsQBYuHkuAKhQPqLjNJBAf_UHvlhvAI5V1vBDPE-GaOz1Aorf-oNHzVde5dNsY22KmRXwnkmrR3bIZCiYCZbAW_Puxd4cX9xxBVyl9CKGxvoLBhhxyPskgyHuRp_NXLSMzY3IgXJcNIpIVt4RSz7U2IMFHEbjpGuy9WrwBPQJ_4vp9lxeZTTlW2WL_vl-zPz7rsAhMOw4qcn51tjFlTHkeCOO4cweonyf1vxlmxISf1XW7c1fLTpz-Iaj6G-19_iAkAh8qPIg&src-supplier=Texas+Instruments; ComponentLink3URL: https://datasheet.octopart.com:443/LMR51450SDRRR-Texas-Instruments-datasheet-168528357.pdf?src-supplier=HQonline; ComponentLink3Description: https://datasheet.octopart.com:443/LMR51450SDRRR-Texas-Instruments-datasheet-168528357.pdf?src-supplier=HQonline; ComponentLink4URL: http://sigma.octopart.com:80/reach_statement/Texas-Instruments-company-64.pdf?src-supplier=Compliance+Statements; ComponentLink4Description: http://sigma.octopart.com:80/reach_statement/Texas-Instruments-company-64.pdf?src-supplier=Compliance+Statements; ComponentLink5URL: http://sigma.octopart.com:80/conflict_mineral_statement/Texas-Instruments-company-63.pdf?src-supplier=Compliance+Statements; ComponentLink5Description: http://sigma.octopart.com:80/conflict_mineral_statement/Texas-Instruments-company-63.pdf?src-supplier=Compliance+Statements
U5 = LT4363IMS-2#PBF: Circuit Protection Misc High Voltage Surge Stopper with Current Limit; Manufacturer: Analog Devices; Manufacturer Part Number: LT4363MPMS-1#TRPBF; Manufacturer Lifecycle Status: PRODUCTION; Clamping Voltage: 27V; Number of Circuits: 1; Working Voltage: 80V; Min Supply Voltage: 4V; Nominal Supply Voltage: 12V; Nominal Supply Current: 700µA; Supplier: Arrow Electronics; Supplier Part Number: LT4363MPMS-1#TRPBF; RoHS: Compliant; Category: Hot Swap Controllers; Pricing: 2500=13,8449 (USD); Lifecycle Status: Production; Pins: 12; Packaging: Tape and Reel; ComponentLink1URL: https://octopart.com:443/opatz8j6/c1?t=g8yZI-WwmnHB_vbMX34rM1w-FVIDuFRStvEBEGjv-t7dY-yn6edyVpvHiGWVwXk36mJtHaakebzYH0pbcDC9nAFzvMX55UE01VpBw0EvuzOYQuQyHVXSkEwA9UrcLhArsI8crRkas2E3x20SSd_j0bG3UdC2S3P2-55djwoCcbCa9x_vW4mWI6Pbbhes42ab_Mm48tbaz0AMQirVxpVGA3itoBnPvYNW2nXIrlFGQrOJUnHEnTZGMHqmHwXgR_Tlx3P7WXantRchJJux0Cl3oIBQ6pMTohaApkUOsGSDa4JuYPEXn45JWQ&src-supplier=Analog+Devices; ComponentLink1Description: https://octopart.com:443/opatz8j6/c1?t=g8yZI-WwmnHB_vbMX34rM1w-FVIDuFRStvEBEGjv-t7dY-yn6edyVpvHiGWVwXk36mJtHaakebzYH0pbcDC9nAFzvMX55UE01VpBw0EvuzOYQuQyHVXSkEwA9UrcLhArsI8crRkas2E3x20SSd_j0bG3UdC2S3P2-55djwoCcbCa9x_vW4mWI6Pbbhes42ab_Mm48tbaz0AMQirVxpVGA3itoBnPvYNW2nXIrlFGQrOJUnHEnTZGMHqmHwXgR_Tlx3P7WXantRchJJux0Cl3oIBQ6pMTohaApkUOsGSDa4JuYPEXn45JWQ&src-supplier=Analog+Devices; ComponentLink2URL: https://datasheet.octopart.com:443/LT4363MPMS-1%23TRPBF-Linear-Technology-datasheet-16808119.pdf?src-supplier=Upverter; ComponentLink2Description: https://datasheet.octopart.com:443/LT4363MPMS-1%23TRPBF-Linear-Technology-datasheet-16808119.pdf?src-supplier=Upverter; ComponentLink3URL: https://datasheet.octopart.com:443/LT4363MPMS-1%23TRPBF-Analog-Devices-datasheet-48003674.pdf?src-supplier=Newchip+Electronics+Limited; ComponentLink3Description: https://datasheet.octopart.com:443/LT4363MPMS-1%23TRPBF-Analog-Devices-datasheet-48003674.pdf?src-supplier=Newchip+Electronics+Limited; ComponentLink4URL: https://sigma.octopart.com:443/57695431/technical_drawing/Linear-Technology-LT4363MPMS-1%23TRPBF.pdf?src-supplier=Linear+Technology; ComponentLink4Description: https://sigma.octopart.com:443/57695431/technical_drawing/Linear-Technology-LT4363MPMS-1%23TRPBF.pdf?src-supplier=Linear+Technology; ComponentLink5URL: http://sigma.octopart.com:80/conflict_mineral_statement/Analog-Devices-company-33.pdf?src-supplier=Compliance+Statements; ComponentLink5Description: http://sigma.octopart.com:80/conflict_mineral_statement/Analog-Devices-company-33.pdf?src-supplier=Compliance+Statements; ComponentLink6URL: https://octopart.com:443/opatz8j6/c1?t=upX8bGaY0C_XhAgK0tvuE4KuG34pd1dqjCgMGSFl4A4VfJwnA-G2iPp1-_xl9tlvp47bIYjpGNIjJgQeIzPXlpvhsBRu-ZZqvMGXOy-0TvtKIjLrlnKqpwMA3gUbHz7op1PS0t33v5G0SwlTw0DW8UOb0qzWfk6qHP7B7oxV7v4SQDT7Kv3aFCYxemazye3958pU0imV6PXlzZXgUE6TdK9BZeuQDHDxv2Lx3eHIn183-cqc5tcQD9qR7x6H9J_DywiqtQ8guaVb2EPAcjERqDFoPchTgqXMyI2T8b-Hn7iuDHJnAWewLw&src-supplier=Compliance+Statements; ComponentLink6Description: https://octopart.com:443/opatz8j6/c1?t=upX8bGaY0C_XhAgK0tvuE4KuG34pd1dqjCgMGSFl4A4VfJwnA-G2iPp1-_xl9tlvp47bIYjpGNIjJgQeIzPXlpvhsBRu-ZZqvMGXOy-0TvtKIjLrlnKqpwMA3gUbHz7op1PS0t33v5G0SwlTw0DW8UOb0qzWfk6qHP7B7oxV7v4SQDT7Kv3aFCYxemazye3958pU0imV6PXlzZXgUE6TdK9BZeuQDHDxv2Lx3eHIn183-cqc5tcQD9qR7x6H9J_DywiqtQ8guaVb2EPAcjERqDFoPchTgqXMyI2T8b-Hn7iuDHJnAWewLw&src-supplier=Compliance+Statements; Stock: 74; Case/Package: MSOP; Height: 860µm; Lead Free: Lead Free; Length: 4.04mm; Max Operating Temperature: 85°C; Max Supply Voltage: 80V; Min Operating Temperature: -40°C; REACH SVHC: No; Schedule B: 8542390000, 8542390000|8542390000|8542390000|8542390000|8542390000; Width: 3mm; ComponentLink7URL: https://datasheet.octopart.com:443/LT4363IMS-2%23PBF-Analog-Devices-datasheet-16808119.pdf?src-supplier=Upverter; ComponentLink7Description: https://datasheet.octopart.com:443/LT4363IMS-2%23PBF-Analog-Devices-datasheet-16808119.pdf?src-supplier=Upverter; ComponentLink8URL: https://octopart.com:443/opatz8j6/c1?t=-IHcXZz8wf17Co3lJavFHjPk-jkjkbeE4FdSPYckKG-W26AH8QtQvgpVO8pSyIYJH4MIluO-quCPdq0IYsrL5xEJfkoWcv9ETdU4LRmwEu_QaNUHWW1x1p2NOujrI1czxFPuXzgNB89LoG9zMgWoaE8idJS3WKmYLS9sBBfM7ivdFLcJ03sPEP5W3TyyvmJEisV6tOozvhDCwz-NbNr_qWq7vIv3e2u2OtMyOZeqdy9MQ7VmyH1OnZ3GHaGImkjZNX9WHhXeQsYdpNQJx9v8Dd7EIeMeRmu2NjR7aH39sP_VGgL-3JzLxA&src-supplier=Analog+Devices; ComponentLink8Description: https://octopart.com:443/opatz8j6/c1?t=-IHcXZz8wf17Co3lJavFHjPk-jkjkbeE4FdSPYckKG-W26AH8QtQvgpVO8pSyIYJH4MIluO-quCPdq0IYsrL5xEJfkoWcv9ETdU4LRmwEu_QaNUHWW1x1p2NOujrI1czxFPuXzgNB89LoG9zMgWoaE8idJS3WKmYLS9sBBfM7ivdFLcJ03sPEP5W3TyyvmJEisV6tOozvhDCwz-NbNr_qWq7vIv3e2u2OtMyOZeqdy9MQ7VmyH1OnZ3GHaGImkjZNX9WHhXeQsYdpNQJx9v8Dd7EIeMeRmu2NjR7aH39sP_VGgL-3JzLxA&src-supplier=Analog+Devices; ComponentLink9URL: https://datasheet.octopart.com:443/LT4363IMS-2%23PBF-Analog-Devices-datasheet-157246151.pdf?src-supplier=Newchip+Electronics+Limited; ComponentLink9Description: https://datasheet.octopart.com:443/LT4363IMS-2%23PBF-Analog-Devices-datasheet-157246151.pdf?src-supplier=Newchip+Electronics+Limited; ComponentLink10URL: https://sigma.octopart.com:443/57695431/technical_drawing/Linear-Technology-LT4363IMS-2%23PBF.pdf?src-supplier=Linear+Technology; ComponentLink10Description: https://sigma.octopart.com:443/57695431/technical_drawing/Linear-Technology-LT4363IMS-2%23PBF.pdf?src-supplier=Linear+Technology; ComponentLink11URL: https://datasheet.octopart.com:443/LT4363IMS-2%23PBF-Linear-Technology-datasheet-11557070.pdf?src-supplier=Arrow+Electronics; ComponentLink11Description: https://datasheet.octopart.com:443/LT4363IMS-2%23PBF-Linear-Technology-datasheet-11557070.pdf?src-supplier=Arrow+Electronics; ComponentLink12URL: https://datasheet.octopart.com:443/LT4363IMS-2%23PBF-Linear-Technology-datasheet-10915746.pdf?src-supplier=Farnell; ComponentLink12Description: https://datasheet.octopart.com:443/LT4363IMS-2%23PBF-Linear-Technology-datasheet-10915746.pdf?src-supplier=Farnell; ComponentLink13URL: https://datasheet.octopart.com:443/LT4363IMS-2%23PBF-Linear-Technology-datasheet-10704508.pdf?src-supplier=Component+Distributors+Inc.; ComponentLink13Description: https://datasheet.octopart.com:443/LT4363IMS-2%23PBF-Linear-Technology-datasheet-10704508.pdf?src-supplier=Component+Distributors+Inc.; ComponentLink14URL: https://octopart.com:443/opatz8j6/c1?t=ov3Kxoe_DC7fAzVY9nj0-62S96ULmO_6ZbMSPat3xYGpsnqzj5canMsxfoRN1ZRc_18gTD_GsfnKt9q-ufd8fGCuFQtTIEPt1KoRkOURSC3Oguhxm71ep0Cxh36by45lKF4SedGJb6NO9ztMtBZMWLsztLg5ZHghx9ADcRyN_CBXFw39hroyNObFrqWfVziCGXaFT18OGdeRBSZDlnW_MpVfTXUUrmwnAM1coZsA5MeT4wFdsSjiSTl4renPEe9RbKBU6R7PCV5lcK1j4lQVbinNQ__ejP83fk6F6QwqnfKsYZRM15WY3A&src-supplier=Compliance+Statements; ComponentLink14Description: https://octopart.com:443/opatz8j6/c1?t=ov3Kxoe_DC7fAzVY9nj0-62S96ULmO_6ZbMSPat3xYGpsnqzj5canMsxfoRN1ZRc_18gTD_GsfnKt9q-ufd8fGCuFQtTIEPt1KoRkOURSC3Oguhxm71ep0Cxh36by45lKF4SedGJb6NO9ztMtBZMWLsztLg5ZHghx9ADcRyN_CBXFw39hroyNObFrqWfVziCGXaFT18OGdeRBSZDlnW_MpVfTXUUrmwnAM1coZsA5MeT4wFdsSjiSTl4renPEe9RbKBU6R7PCV5lcK1j4lQVbinNQ__ejP83fk6F6QwqnfKsYZRM15WY3A&src-supplier=Compliance+Statements